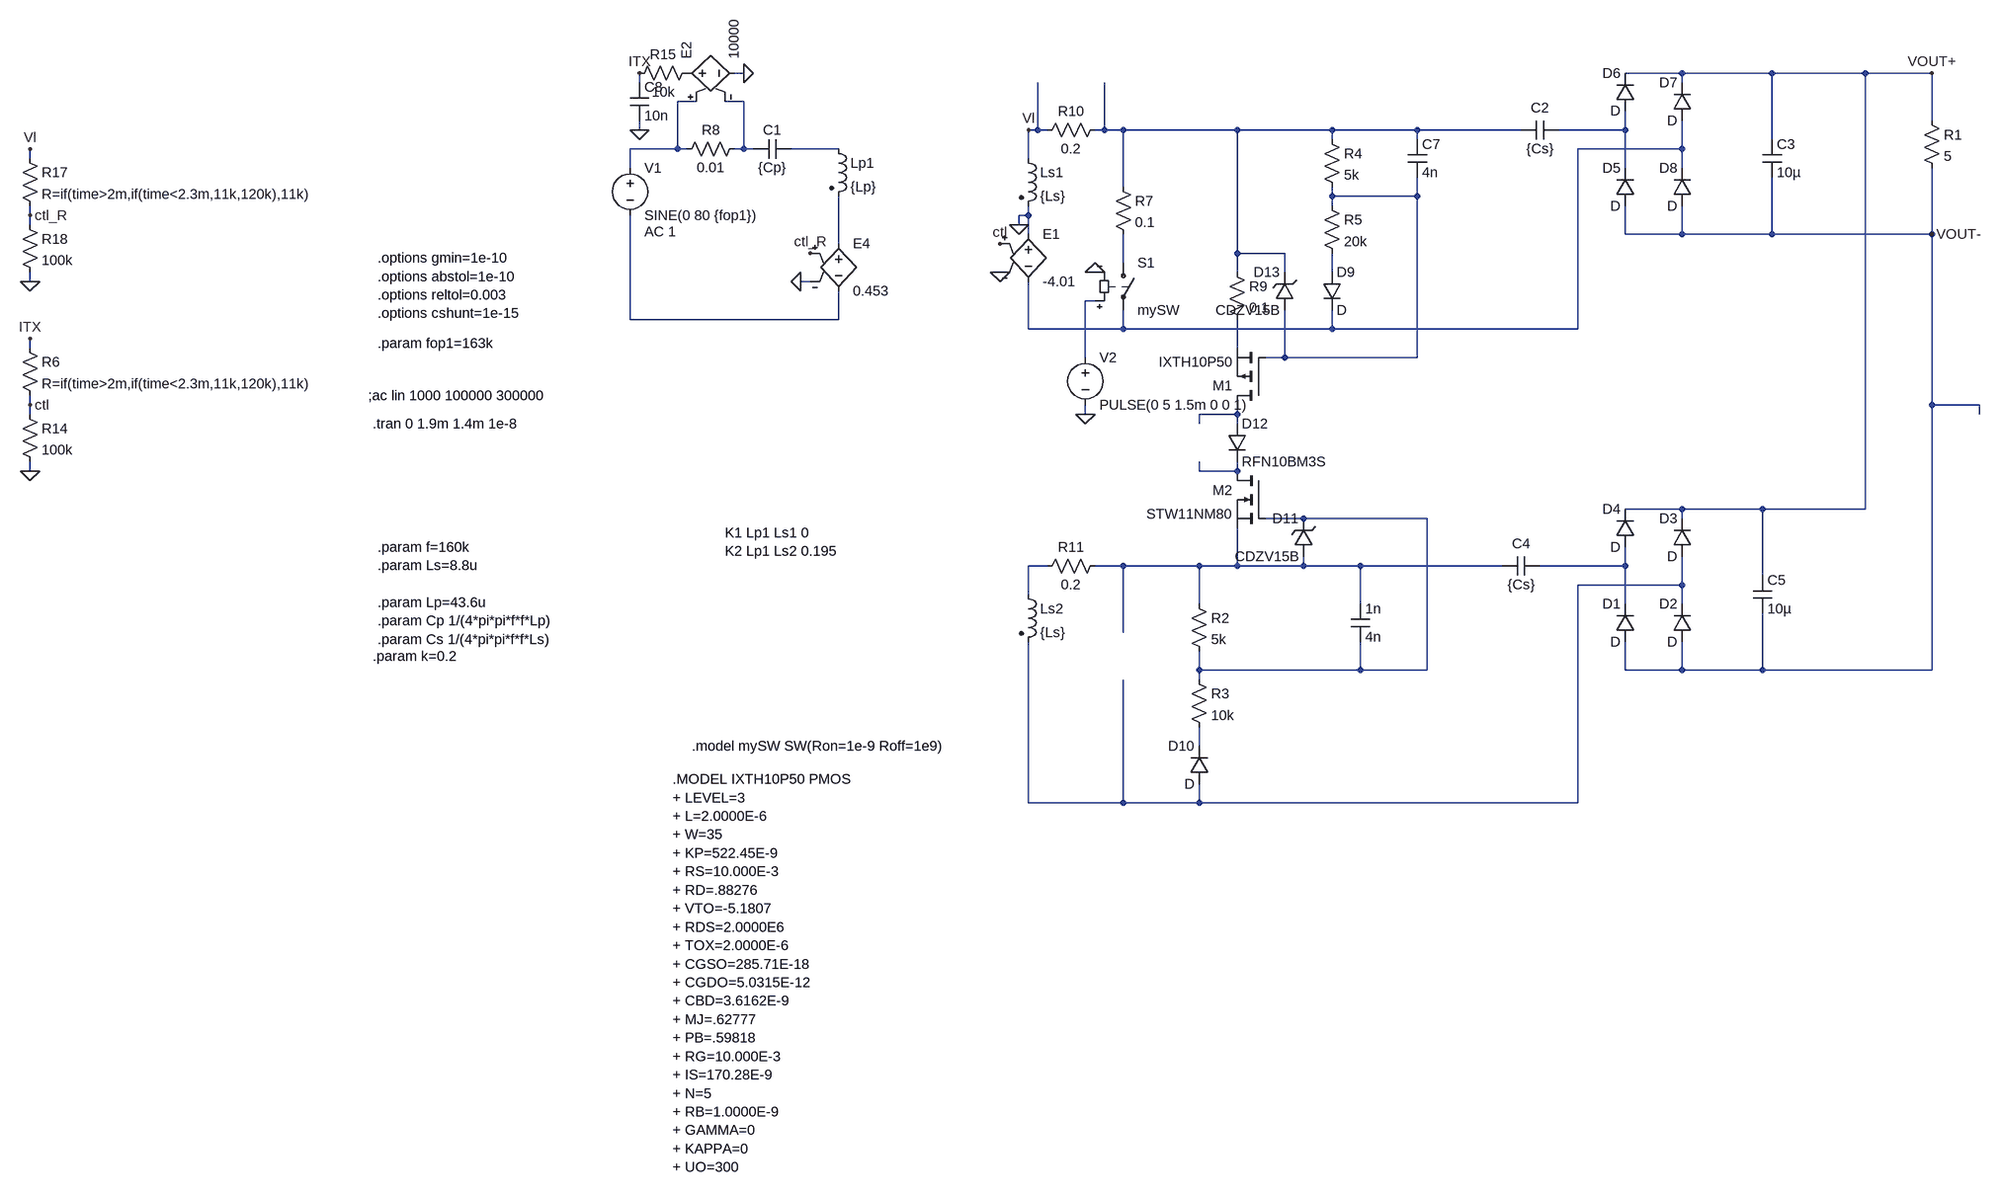
[diagram p0: schematic WPT_voltage_set_figure.asc]
WPT_voltage_set_figure.asc, the LTspice schematic file:
Version 4
SHEET 1 1300 1268
WIRE -1136 -528 -1152 -528
WIRE 720 -528 624 -528
WIRE 880 -528 720 -528
WIRE 1104 -528 880 -528
WIRE 1216 -528 1104 -528
WIRE -1312 -512 -1312 -528
WIRE 720 -512 720 -528
WIRE -1216 -480 -1248 -480
WIRE -1136 -480 -1168 -480
WIRE 1216 -448 1216 -528
WIRE -1312 -432 -1312 -448
WIRE -640 -432 -640 -512
WIRE -640 -432 -656 -432
WIRE -624 -432 -640 -432
WIRE -528 -432 -528 -512
WIRE -528 -432 -544 -432
WIRE -496 -432 -528 -432
WIRE -304 -432 -496 -432
WIRE -144 -432 -304 -432
WIRE 0 -432 -144 -432
WIRE 448 -432 0 -432
WIRE 624 -432 624 -464
WIRE 624 -432 512 -432
WIRE -144 -416 -144 -432
WIRE 0 -416 0 -432
WIRE 880 -416 880 -528
WIRE -1248 -400 -1248 -480
WIRE -1248 -400 -1328 -400
WIRE -1232 -400 -1248 -400
WIRE -1136 -400 -1136 -480
WIRE -1136 -400 -1152 -400
WIRE -1120 -400 -1136 -400
WIRE -976 -400 -1056 -400
WIRE 720 -400 720 -448
WIRE 720 -400 544 -400
WIRE -2640 -384 -2640 -400
WIRE -656 -384 -656 -432
WIRE -1328 -368 -1328 -400
WIRE 624 -368 624 -432
WIRE 720 -368 720 -400
WIRE -496 -336 -496 -432
WIRE -144 -320 -144 -336
WIRE 0 -320 0 -352
WIRE 0 -320 -144 -320
WIRE -144 -304 -144 -320
WIRE -2640 -288 -2640 -304
WIRE -656 -288 -656 -304
WIRE -656 -288 -672 -288
WIRE -2640 -272 -2640 -288
WIRE -672 -272 -672 -288
WIRE -656 -256 -656 -288
WIRE 624 -256 624 -304
WIRE 720 -256 720 -304
WIRE 720 -256 624 -256
WIRE 880 -256 880 -352
WIRE 880 -256 720 -256
WIRE 1216 -256 1216 -368
WIRE 1216 -256 880 -256
WIRE -976 -240 -976 -320
WIRE -304 -224 -304 -432
WIRE -224 -224 -304 -224
WIRE -496 -208 -496 -256
WIRE -304 -192 -304 -224
WIRE -224 -192 -224 -224
WIRE -144 -192 -144 -224
WIRE -2640 -176 -2640 -192
WIRE -1024 -176 -1040 -176
WIRE -544 -144 -560 -144
WIRE -1328 -112 -1328 -288
WIRE -976 -112 -976 -160
WIRE -976 -112 -1328 -112
WIRE -656 -96 -656 -176
WIRE -496 -96 -496 -128
WIRE -496 -96 -656 -96
WIRE -144 -96 -144 -128
WIRE -144 -96 -496 -96
WIRE 544 -96 544 -400
WIRE 544 -96 -144 -96
WIRE -2640 -64 -2640 -80
WIRE -304 -64 -304 -112
WIRE -560 -48 -560 -144
WIRE -224 -48 -224 -128
WIRE -224 -48 -256 -48
WIRE 0 -48 0 -320
WIRE 0 -48 -224 -48
WIRE -2640 32 -2640 16
WIRE 1216 32 1216 -256
WIRE 1296 32 1216 32
WIRE -2640 48 -2640 32
WIRE -560 48 -560 32
WIRE -304 48 -304 32
WIRE -304 48 -368 48
WIRE 1296 48 1296 32
WIRE -368 64 -368 48
WIRE -304 64 -304 48
WIRE -2640 144 -2640 128
WIRE -368 144 -368 128
WIRE -304 144 -304 128
WIRE -304 144 -368 144
WIRE 720 208 624 208
WIRE 864 208 720 208
WIRE 1104 208 1104 -528
WIRE 1104 208 864 208
WIRE -192 224 -256 224
WIRE 16 224 -192 224
WIRE 720 224 720 208
WIRE -624 304 -656 304
WIRE -496 304 -544 304
WIRE -368 304 -496 304
WIRE -304 304 -304 240
WIRE -304 304 -368 304
WIRE -192 304 -192 288
WIRE -192 304 -304 304
WIRE -96 304 -192 304
WIRE 416 304 -96 304
WIRE 624 304 624 272
WIRE 624 304 480 304
WIRE 864 320 864 208
WIRE 720 336 720 288
WIRE 720 336 544 336
WIRE -656 352 -656 304
WIRE -368 368 -368 304
WIRE -96 368 -96 304
WIRE 624 368 624 304
WIRE 720 368 720 336
WIRE -496 416 -496 304
WIRE -368 480 -368 448
WIRE -96 480 -96 432
WIRE -96 480 -368 480
WIRE 16 480 16 224
WIRE 16 480 -96 480
WIRE 624 480 624 432
WIRE 720 480 720 432
WIRE 720 480 624 480
WIRE 864 480 864 384
WIRE 864 480 720 480
WIRE 1216 480 1216 32
WIRE 1216 480 864 480
WIRE -368 496 -368 480
WIRE -368 608 -368 576
WIRE -656 704 -656 432
WIRE -496 704 -496 496
WIRE -496 704 -656 704
WIRE -368 704 -368 672
WIRE -368 704 -496 704
WIRE 544 704 544 336
WIRE 544 704 -368 704
FLAG 1216 -256 VOUT-
FLAG 1216 -528 VOUT+
FLAG -656 -432 Vl
FLAG -704 -192 0
FLAG -672 -272 0
FLAG -2640 144 0
FLAG -2640 32 ctl
FLAG -704 -240 ctl
FLAG -1136 -528 0
FLAG -1312 -432 0
FLAG -1312 -528 ITX
FLAG -2640 -80 ITX
FLAG -2640 -176 0
FLAG -2640 -288 ctl_R
FLAG -1040 -176 0
FLAG -1024 -224 ctl_R
FLAG -2640 -400 Vl
FLAG -544 -192 0
FLAG -560 48 0
SYMBOL ind2 -992 -416 R0
SYMATTR InstName Lp1
SYMATTR Value {Lp}
SYMATTR Type ind
SYMBOL cap -1056 -416 R90
WINDOW 0 0 32 VBottom 2
WINDOW 3 32 32 VTop 2
SYMATTR InstName C1
SYMATTR Value {Cp}
SYMBOL ind2 -672 -400 R0
SYMATTR InstName Ls1
SYMATTR Value {Ls}
SYMATTR Type ind
SYMBOL cap 512 -448 R90
WINDOW 0 -6 32 VBottom 2
WINDOW 3 32 32 VTop 2
SYMATTR InstName C2
SYMATTR Value {Cs}
SYMBOL cap 864 -416 R0
SYMATTR InstName C3
SYMATTR Value 10µ
SYMBOL res 1200 -464 R0
SYMATTR InstName R1
SYMATTR Value 5
SYMBOL ind2 -672 336 R0
SYMATTR InstName Ls2
SYMATTR Value {Ls}
SYMATTR Type ind
SYMBOL cap 480 288 R90
WINDOW 0 -6 32 VBottom 2
WINDOW 3 32 32 VTop 2
SYMATTR InstName C4
SYMATTR Value {Cs}
SYMBOL cap 848 320 R0
SYMATTR InstName C5
SYMATTR Value 10µ
SYMBOL voltage -1328 -384 R0
WINDOW 123 24 124 Left 2
WINDOW 39 0 0 Left 0
SYMATTR Value2 AC 1
SYMATTR InstName V1
SYMATTR Value SINE(0 80 {fop1})
SYMBOL res -384 352 R0
SYMATTR InstName R2
SYMATTR Value 5k
SYMBOL res -384 480 R0
SYMATTR InstName R3
SYMATTR Value 10k
SYMBOL pmos -256 32 R180
SYMATTR InstName M1
SYMATTR Value IXTH10P50
SYMBOL nmos -256 144 M0
SYMATTR InstName M2
SYMATTR Value STW11NM80
SYMBOL diode 640 432 R180
WINDOW 0 24 64 Left 2
WINDOW 3 24 0 Left 2
SYMATTR InstName D1
SYMBOL diode 736 432 R180
WINDOW 0 24 64 Left 2
WINDOW 3 24 0 Left 2
SYMATTR InstName D2
SYMBOL diode 736 288 R180
WINDOW 0 24 64 Left 2
WINDOW 3 24 0 Left 2
SYMATTR InstName D3
SYMBOL diode 640 272 R180
WINDOW 0 24 64 Left 2
WINDOW 3 24 0 Left 2
SYMATTR InstName D4
SYMBOL diode 640 -304 R180
WINDOW 0 24 64 Left 2
WINDOW 3 24 0 Left 2
SYMATTR InstName D5
SYMBOL diode 640 -464 R180
WINDOW 0 24 64 Left 2
WINDOW 3 24 0 Left 2
SYMATTR InstName D6
SYMBOL diode 736 -448 R180
WINDOW 0 24 64 Left 2
WINDOW 3 24 0 Left 2
SYMATTR InstName D7
SYMBOL diode 736 -304 R180
WINDOW 0 24 64 Left 2
WINDOW 3 24 0 Left 2
SYMATTR InstName D8
SYMBOL res -512 -352 R0
SYMATTR InstName R7
SYMATTR Value 0.1
SYMBOL res -1136 -416 R90
WINDOW 0 0 56 VBottom 2
WINDOW 3 32 56 VTop 2
SYMATTR InstName R8
SYMATTR Value 0.01
SYMBOL diode -352 672 R180
WINDOW 0 24 64 Left 2
WINDOW 3 24 0 Left 2
SYMATTR InstName D10
SYMBOL res -528 -448 R90
WINDOW 0 0 56 VBottom 2
WINDOW 3 32 56 VTop 2
SYMATTR InstName R10
SYMATTR Value 0.2
SYMBOL res -528 288 R90
WINDOW 0 0 56 VBottom 2
WINDOW 3 32 56 VTop 2
SYMATTR InstName R11
SYMATTR Value 0.2
SYMBOL cap -112 368 R0
SYMATTR InstName 1n
SYMATTR Value 4n
SYMBOL e -656 -272 R0
SYMATTR InstName E1
SYMATTR Value -4.01
SYMBOL res -2656 -80 R0
SYMATTR InstName R6
SYMATTR Value R=if(time>2m,if(time<2.3m,11k,120k),11k)
SYMBOL res -2656 32 R0
SYMATTR InstName R14
SYMATTR Value 100k
SYMBOL e -1248 -528 R270
SYMATTR InstName E2
SYMATTR Value 10000
SYMBOL cap -1328 -512 R0
SYMATTR InstName C8
SYMATTR Value 10n
SYMBOL res -1216 -544 R90
WINDOW 0 0 56 VBottom 2
WINDOW 3 32 56 VTop 2
SYMATTR InstName R15
SYMATTR Value 10k
SYMBOL res -2656 -400 R0
SYMATTR InstName R17
SYMATTR Value R=if(time>2m,if(time<2.3m,11k,120k),11k)
SYMBOL res -2656 -288 R0
SYMATTR InstName R18
SYMATTR Value 100k
SYMBOL e -976 -256 R0
SYMATTR InstName E4
SYMATTR Value 0.453
SYMBOL res -160 -432 R0
SYMATTR InstName R4
SYMATTR Value 5k
SYMBOL res -160 -320 R0
SYMATTR InstName R5
SYMATTR Value 20k
SYMBOL diode -160 -192 R0
SYMATTR InstName D9
SYMBOL cap -16 -416 R0
SYMATTR InstName C7
SYMATTR Value 4n
SYMBOL zener -208 -128 R180
WINDOW 0 24 64 Left 2
WINDOW 3 24 0 Left 2
SYMATTR InstName D13
SYMATTR Value CDZV15B
SYMATTR Description Diode
SYMATTR Type diode
SYMBOL zener -176 288 R180
WINDOW 0 24 64 Left 2
WINDOW 3 24 0 Left 2
SYMATTR InstName D11
SYMATTR Value CDZV15B
SYMATTR Description Diode
SYMATTR Type diode
SYMBOL res -320 -208 R0
SYMATTR InstName R9
SYMATTR Value 0.1
SYMBOL diode -320 64 R0
SYMATTR InstName D12
SYMATTR Value RFN10BM3S
SYMBOL sw -496 -224 R0
SYMATTR InstName S1
SYMATTR Value mySW
SYMBOL voltage -560 -64 R0
WINDOW 123 0 0 Left 0
WINDOW 39 0 0 Left 0
SYMATTR InstName V2
SYMATTR Value PULSE(0 5 1.5m 0 0 1)
TEXT -1800 64 Left 2 !.tran 0 1.9m 1.4m 1e-8
TEXT -1792 272 Left 2 !.param f=160k  \n.param Ls=8.8u\n \n.param Lp=43.6u\n.param Cp 1/(4*pi*pi*f*f*Lp)\n.param Cs 1/(4*pi*pi*f*f*Ls)
TEXT -1808 16 Left 2 !;ac lin 1000 100000 300000
TEXT -1792 -72 Left 2 !.param fop1=163k
TEXT -1792 -216 Left 2 !.options gmin=1e-10   \n.options abstol=1e-10  \n.options reltol=0.003  \n.options cshunt=1e-15
TEXT -1168 248 Left 2 !K1 Lp1 Ls1 0\nK2 Lp1 Ls2 0.195
TEXT -1800 456 Left 2 !.param k=0.2
TEXT -1224 608 Left 2 !.model mySW SW(Ron=1e-9 Roff=1e9)
TEXT -1256 664 Left 2 !.MODEL IXTH10P50 PMOS\n+ LEVEL=3\n+ L=2.0000E-6\n+ W=35\n+ KP=522.45E-9\n+ RS=10.000E-3\n+ RD=.88276\n+ VTO=-5.1807\n+ RDS=2.0000E6\n+ TOX=2.0000E-6\n+ CGSO=285.71E-18\n+ CGDO=5.0315E-12\n+ CBD=3.6162E-9\n+ MJ=.62777\n+ PB=.59818\n+ RG=10.000E-3\n+ IS=170.28E-9\n+ N=5\n+ RB=1.0000E-9\n+ GAMMA=0\n+ KAPPA=0\n+ UO=300

The netlist it stands for:
* WPT_voltage_set_figure.asc
Lp1 N005 N008 {Lp}
C1 N005 N002 {Cp}
Ls1 Vl 0 {Ls}
C2 N004 N003 {Cs}
C3 VOUT+ VOUT- 10µ
R1 VOUT+ VOUT- 5
Ls2 N017 N020 {Ls}
C4 N019 N018 {Cs}
C5 VOUT+ VOUT- 10µ
V1 N001 N012 SINE(0 80 {fop1}) AC 1
R2 N018 N016 5k
R3 N016 N021 10k
M1 N014 N007 N013 N013 IXTH10P50
M2 N015 N016 N018 N018 STW11NM80
D1 VOUT- N019 D
D2 VOUT- N020 D
D3 N020 VOUT+ D
D4 N019 VOUT+ D
D5 VOUT- N004 D
D6 N004 VOUT+ D
D7 N006 VOUT+ D
D8 VOUT- N006 D
R7 N003 N009 0.1
R8 N002 N001 0.01
D10 N020 N021 D
R10 N003 Vl 0.2
R11 N018 N017 0.2
C§1n N018 N016 4n
E1 0 N006 ctl 0 -4.01
R6 ITX ctl R=if(time>2m,if(time<2.3m,11k,120k),11k)
R14 ctl 0 100k
E2 P001 0 N001 N002 10000
C8 ITX 0 10n
R15 P001 ITX 10k
R17 Vl ctl_R R=if(time>2m,if(time<2.3m,11k,120k),11k)
R18 ctl_R 0 100k
E4 N008 N012 ctl_R 0 0.453
R4 N003 N007 5k
R5 N007 N010 20k
D9 N010 N006 D
C7 N003 N007 4n
D13 N007 N003 CDZV15B
D11 N018 N016 CDZV15B
R9 N003 N013 0.1
D12 N014 N015 RFN10BM3S
S1 N009 N006 N011 0 mySW
V2 N011 0 PULSE(0 5 1.5m 0 0 1)
.model D D
.lib standard.dio
.model NMOS NMOS
.model PMOS PMOS
.lib standard.mos
.tran 0 1.9m 1.4m 1e-8
.param f=160k
.param Ls=8.8u
.param Lp=43.6u
.param Cp 1/(4*pi*pi*f*f*Lp)
.param Cs 1/(4*pi*pi*f*f*Ls)
;ac lin 1000 100000 300000
.param fop1=163k
.options gmin=1e-10
.options abstol=1e-10
.options reltol=0.003
.options cshunt=1e-15
K1 Lp1 Ls1 0
K2 Lp1 Ls2 0.195
.param k=0.2
.model mySW SW(Ron=1e-9 Roff=1e9)
.MODEL IXTH10P50 PMOS
+ LEVEL=3
+ L=2.0000E-6
+ W=35
+ KP=522.45E-9
+ RS=10.000E-3
+ RD=.88276
+ VTO=-5.1807
+ RDS=2.0000E6
+ TOX=2.0000E-6
+ CGSO=285.71E-18
+ CGDO=5.0315E-12
+ CBD=3.6162E-9
+ MJ=.62777
+ PB=.59818
+ RG=10.000E-3
+ IS=170.28E-9
+ N=5
+ RB=1.0000E-9
+ GAMMA=0
+ KAPPA=0
+ UO=300
.backanno
.end